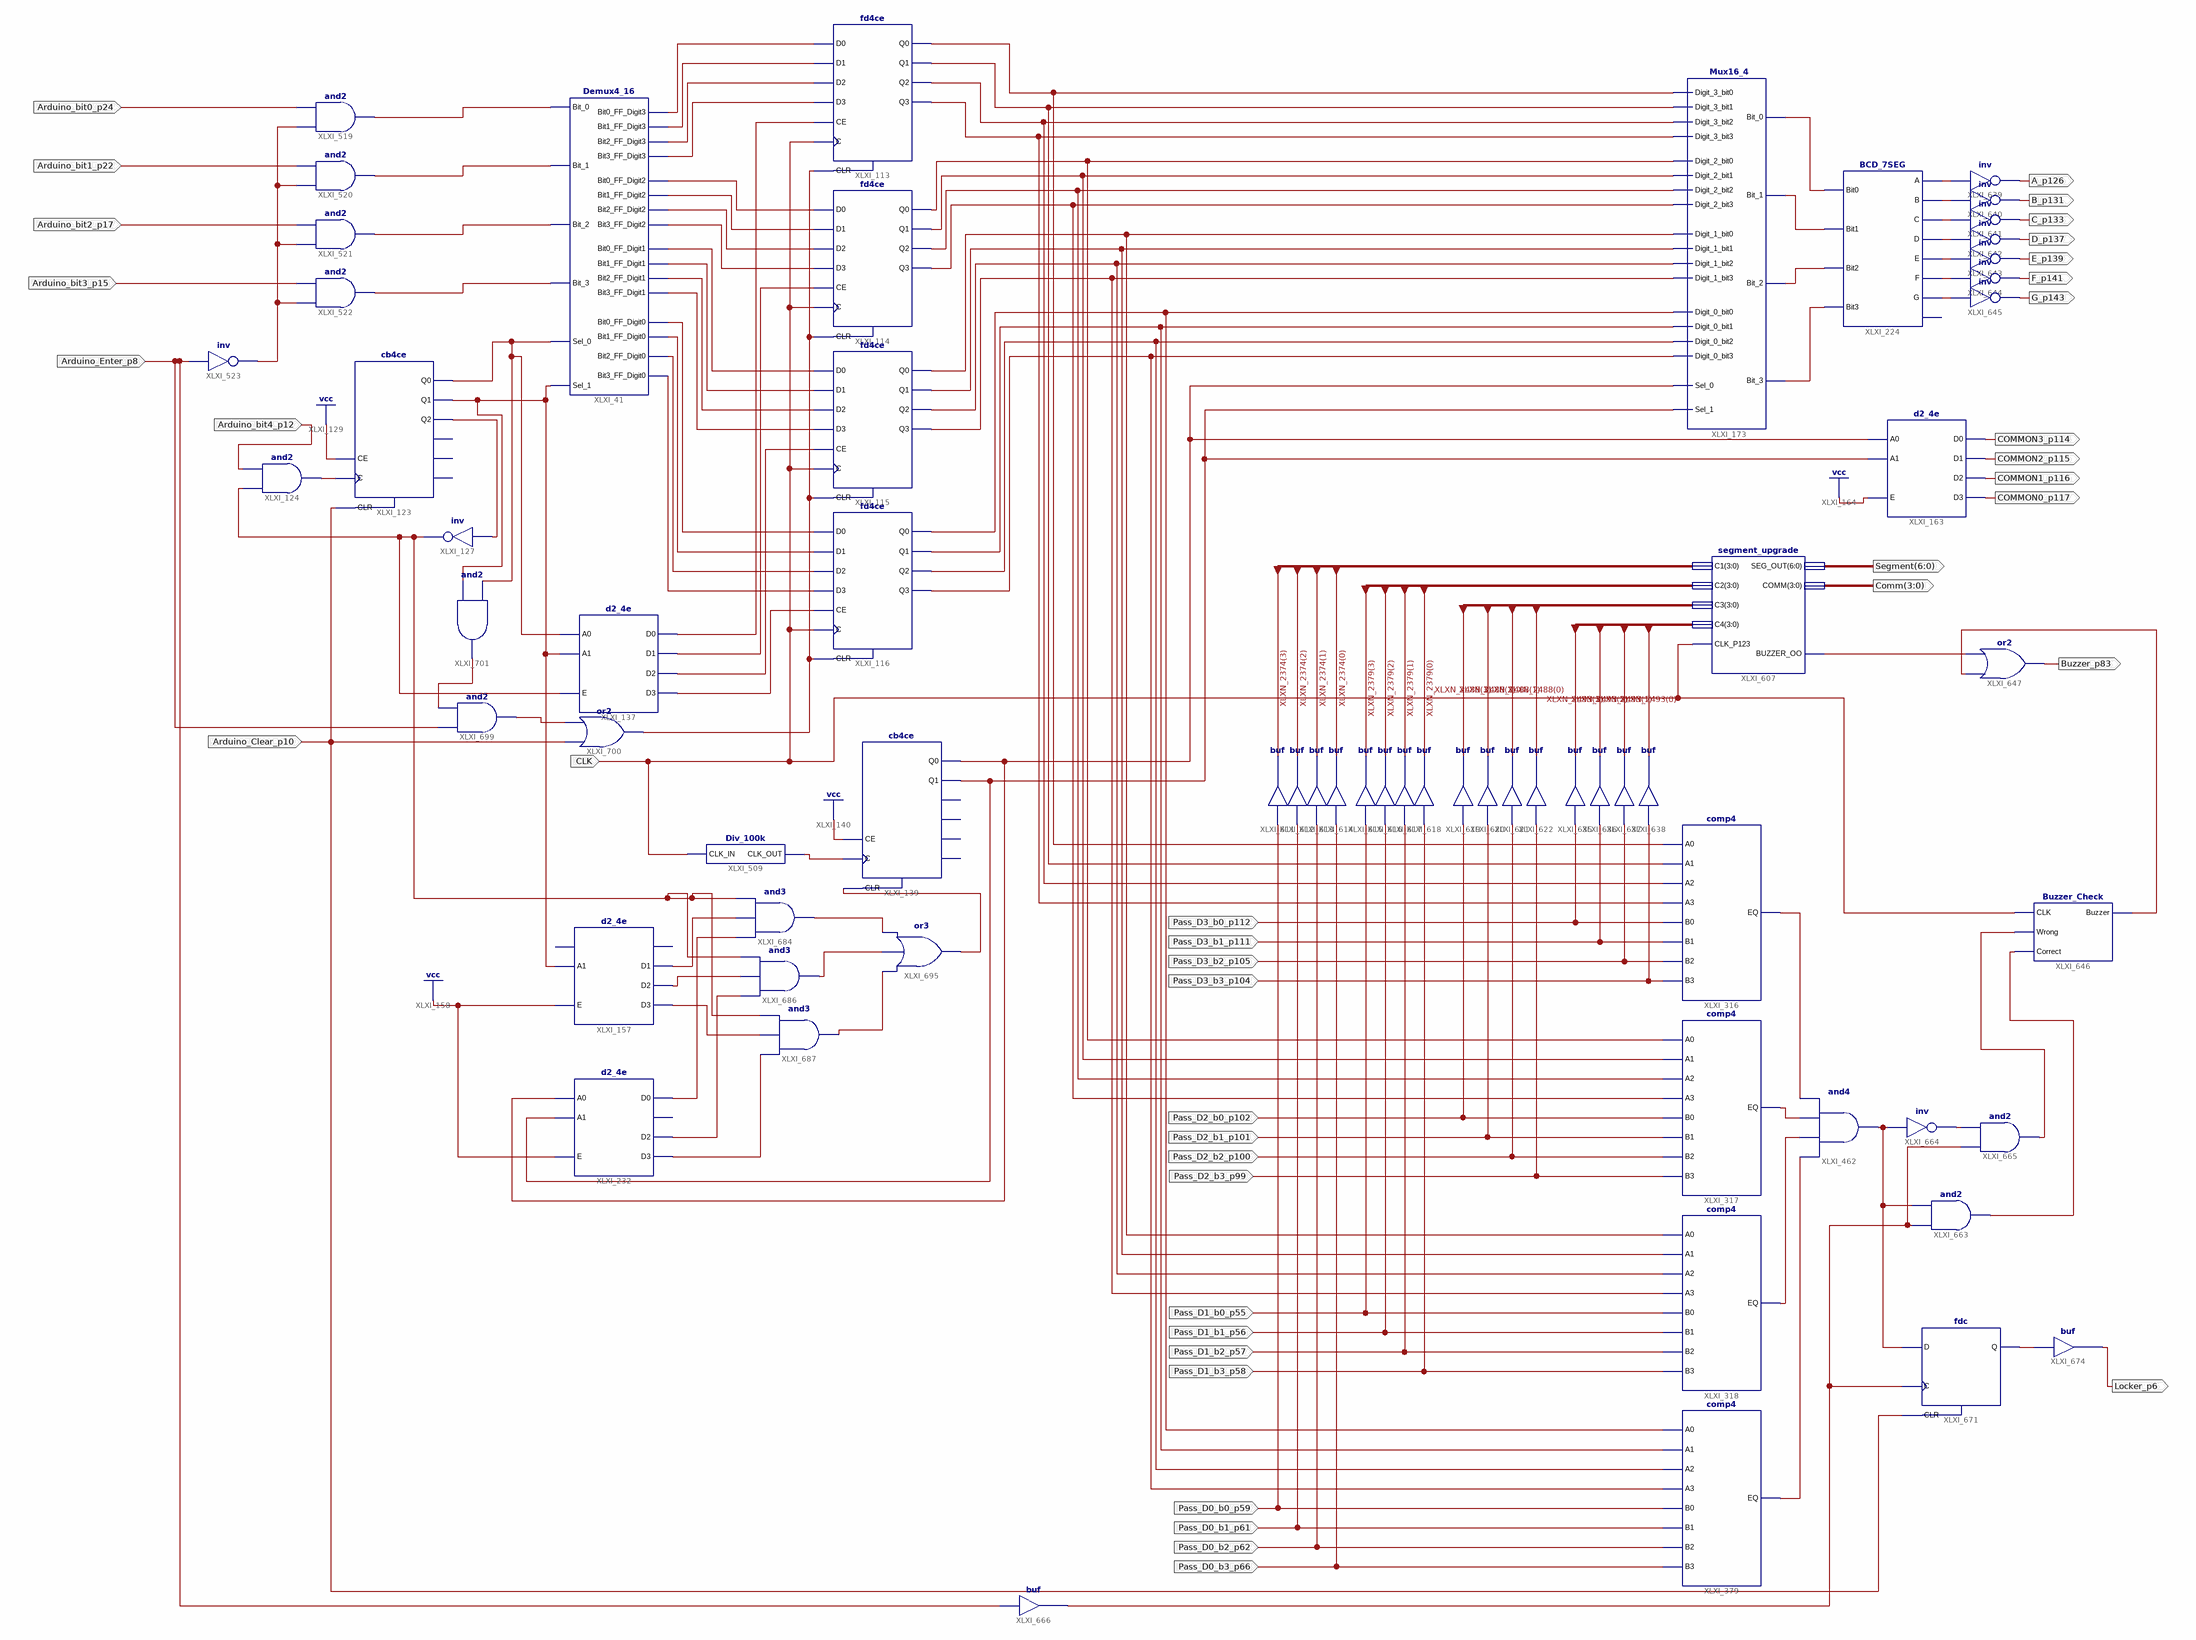
[diagram p0: schematic sheet 1]
// Xilinx ISE schematic Digital_Locker.sch (spartan6) as structural Verilog: 65 symbols, 39 ports
module Digital_Locker (
  input  Arduino_Clear_p10,
  input  Arduino_bit4_p12,
  input  Pass_D1_b0_p55,
  input  Pass_D1_b1_p56,
  input  Pass_D1_b2_p57,
  input  Pass_D1_b3_p58,
  input  Arduino_bit0_p24,
  input  Arduino_bit1_p22,
  input  Arduino_bit2_p17,
  input  Arduino_bit3_p15,
  input  Arduino_Enter_p8,
  input  Pass_D3_b0_p112,
  input  Pass_D3_b1_p111,
  input  Pass_D3_b2_p105,
  input  Pass_D3_b3_p104,
  input  Pass_D0_b0_p59,
  input  Pass_D0_b1_p61,
  input  Pass_D0_b2_p62,
  input  Pass_D2_b0_p102,
  input  Pass_D2_b1_p101,
  input  Pass_D2_b2_p100,
  input  Pass_D2_b3_p99,
  input  CLK,
  input  Pass_D0_b3_p66,
  output [6:0] Segment,
  output [3:0] Comm,
  output A_p126,
  output B_p131,
  output C_p133,
  output D_p137,
  output E_p139,
  output F_p141,
  output G_p143,
  output Buzzer_p83,
  output COMMON0_p117,
  output COMMON1_p116,
  output COMMON2_p115,
  output COMMON3_p114,
  output Locker_p6
);

  wire XLXN_517, XLXN_528, XLXN_545, XLXN_546, XLXN_547, XLXN_548, XLXN_549, XLXN_550, XLXN_551, XLXN_552,
       XLXN_553, XLXN_554, XLXN_555, XLXN_556, XLXN_557, XLXN_558, XLXN_559, XLXN_560, XLXN_587, XLXN_588,
       XLXN_589, XLXN_590, XLXN_758, XLXN_822, XLXN_823, XLXN_824, XLXN_825, XLXN_1236, XLXN_1237, XLXN_1238,
       XLXN_1239, XLXN_1240, XLXN_1241, XLXN_1242, XLXN_1243, XLXN_1244, XLXN_1245, XLXN_1246, XLXN_1247,
       XLXN_1250, XLXN_1251, XLXN_1252, XLXN_1556, XLXN_1557, XLXN_1558, XLXN_1559, XLXN_1913, XLXN_1953,
       XLXN_1954, XLXN_1955, XLXN_1956, XLXN_1961, XLXN_2069, XLXN_2506, XLXN_2507, XLXN_2508, XLXN_2509,
       XLXN_2510, XLXN_2511, XLXN_2512, XLXN_2553, XLXN_2556, XLXN_2636, XLXN_2644, XLXN_2655, XLXN_2659,
       XLXN_2666, XLXN_2738, XLXN_2861, XLXN_2866, XLXN_2867, XLXN_2868, XLXN_2875, XLXN_2885, XLXN_2886,
       XLXN_2891, XLXN_2892, XLXN_2893, XLXN_2931, XLXN_2942, XLXN_2944, XLXN_2949, XLXN_2956, XLXN_2963,
       XLXN_2964;
  wire [3:0] XLXN_2374, XLXN_2379, XLXN_2488, XLXN_2493;

  and XLXI_124 (XLXN_528, XLXN_2931, Arduino_bit4_p12);
  Mux16_4 XLXI_173 (
    .Bit_1(XLXN_823), .Digit_2_bit3(XLXN_1240), .Digit_3_bit0(XLXN_1239), .Digit_3_bit1(XLXN_1238),
    .Digit_3_bit2(XLXN_1237), .Digit_3_bit3(XLXN_1236), .Digit_2_bit0(XLXN_1243), .Digit_2_bit1(XLXN_1242),
    .Digit_2_bit2(XLXN_1241), .Digit_1_bit0(XLXN_1247), .Digit_1_bit3(XLXN_1244), .Digit_1_bit1(XLXN_1246),
    .Digit_1_bit2(XLXN_1245), .Digit_0_bit0(XLXN_1252), .Digit_0_bit1(XLXN_1251), .Digit_0_bit2(XLXN_1250),
    .Digit_0_bit3(XLXN_758), .Sel_1(XLXN_2069), .Sel_0(XLXN_2666), .Bit_0(XLXN_822), .Bit_3(XLXN_825),
    .Bit_2(XLXN_824));
  d2_4e XLXI_232 (
    .A0(XLXN_2666), .A1(XLXN_2069), .E(1'b1), .D0(XLXN_2868), .D2(XLXN_2886), .D3(XLXN_2892));  // open: D1
  d2_4e XLXI_157 (.A1(XLXN_2963), .E(1'b1), .D1(XLXN_2867), .D2(XLXN_2875), .D3(XLXN_2891));  // open: A0, D0
  fd4ce XLXI_114 (
    .C(CLK), .CE(XLXN_589), .CLR(XLXN_2949), .D0(XLXN_549), .D1(XLXN_550), .D2(XLXN_551), .D3(XLXN_552),
    .Q0(XLXN_1243), .Q1(XLXN_1242), .Q2(XLXN_1241), .Q3(XLXN_1240));
  not XLXI_127 (XLXN_2931, XLXN_517);
  d2_4e XLXI_137 (
    .A0(XLXN_2964), .A1(XLXN_2963), .E(XLXN_2931), .D0(XLXN_590), .D1(XLXN_589), .D2(XLXN_588), .D3(XLXN_587));
  cb4ce XLXI_123 (
    .C(XLXN_528), .CE(1'b1), .CLR(Arduino_Clear_p10), .Q0(XLXN_2964), .Q1(XLXN_2963), .Q2(XLXN_517));  // open: CEO, Q3, TC
  fd4ce XLXI_116 (
    .C(CLK), .CE(XLXN_587), .CLR(XLXN_2949), .D0(XLXN_557), .D1(XLXN_558), .D2(XLXN_559), .D3(XLXN_560),
    .Q0(XLXN_1252), .Q1(XLXN_1251), .Q2(XLXN_1250), .Q3(XLXN_758));
  fd4ce XLXI_115 (
    .C(CLK), .CE(XLXN_588), .CLR(XLXN_2949), .D0(XLXN_553), .D1(XLXN_554), .D2(XLXN_555), .D3(XLXN_556),
    .Q0(XLXN_1247), .Q1(XLXN_1246), .Q2(XLXN_1245), .Q3(XLXN_1244));
  fd4ce XLXI_113 (
    .C(CLK), .CE(XLXN_590), .CLR(XLXN_2949), .D0(XLXN_545), .D1(XLXN_546), .D2(XLXN_547), .D3(XLXN_548),
    .Q0(XLXN_1239), .Q1(XLXN_1238), .Q2(XLXN_1237), .Q3(XLXN_1236));
  Demux4_16 XLXI_41 (
    .Bit_0(XLXN_1953), .Bit_1(XLXN_1954), .Bit_2(XLXN_1955), .Bit_3(XLXN_1956), .Sel_0(XLXN_2964),
    .Bit0_FF_Digit3(XLXN_545), .Bit1_FF_Digit3(XLXN_546), .Bit2_FF_Digit3(XLXN_547),
    .Bit3_FF_Digit3(XLXN_548), .Bit0_FF_Digit2(XLXN_549), .Bit1_FF_Digit2(XLXN_550),
    .Bit2_FF_Digit2(XLXN_551), .Bit3_FF_Digit2(XLXN_552), .Bit0_FF_Digit1(XLXN_553),
    .Bit1_FF_Digit1(XLXN_554), .Sel_1(XLXN_2963), .Bit2_FF_Digit1(XLXN_555), .Bit3_FF_Digit1(XLXN_556),
    .Bit1_FF_Digit0(XLXN_558), .Bit0_FF_Digit0(XLXN_557), .Bit3_FF_Digit0(XLXN_560), .Bit2_FF_Digit0(XLXN_559));
  Div_100k XLXI_509 (.CLK_IN(CLK), .CLK_OUT(XLXN_1913));
  and XLXI_519 (XLXN_1953, XLXN_1961, Arduino_bit0_p24);
  and XLXI_520 (XLXN_1954, XLXN_1961, Arduino_bit1_p22);
  and XLXI_521 (XLXN_1955, XLXN_1961, Arduino_bit2_p17);
  and XLXI_522 (XLXN_1956, XLXN_1961, Arduino_bit3_p15);
  not XLXI_523 (XLXN_1961, Arduino_Enter_p8);
  cb4ce XLXI_139 (.C(XLXN_1913), .CE(1'b1), .CLR(XLXN_2861), .Q0(XLXN_2666), .Q1(XLXN_2069));  // open: CEO, Q2, Q3, TC
  buf XLXI_619 (XLXN_2488[3], Pass_D2_b0_p102);
  buf XLXI_620 (XLXN_2488[2], Pass_D2_b1_p101);
  buf XLXI_621 (XLXN_2488[1], Pass_D2_b2_p100);
  buf XLXI_622 (XLXN_2488[0], Pass_D2_b3_p99);
  and XLXI_462 (XLXN_2636, XLXN_1559, XLXN_1558, XLXN_1557, XLXN_1556);
  comp4 XLXI_316 (
    .A0(XLXN_1239), .A1(XLXN_1238), .A2(XLXN_1237), .A3(XLXN_1236), .B0(Pass_D3_b0_p112),
    .B1(Pass_D3_b1_p111), .B2(Pass_D3_b2_p105), .B3(Pass_D3_b3_p104), .EQ(XLXN_1556));
  comp4 XLXI_317 (
    .A0(XLXN_1243), .A1(XLXN_1242), .A2(XLXN_1241), .A3(XLXN_1240), .B0(Pass_D2_b0_p102),
    .B1(Pass_D2_b1_p101), .B2(Pass_D2_b2_p100), .B3(Pass_D2_b3_p99), .EQ(XLXN_1557));
  comp4 XLXI_318 (
    .A0(XLXN_1247), .A1(XLXN_1246), .A2(XLXN_1245), .A3(XLXN_1244), .B0(Pass_D1_b0_p55), .B1(Pass_D1_b1_p56),
    .B2(Pass_D1_b2_p57), .B3(Pass_D1_b3_p58), .EQ(XLXN_1558));
  comp4 XLXI_379 (
    .A0(XLXN_1252), .A1(XLXN_1251), .A2(XLXN_1250), .A3(XLXN_758), .B0(Pass_D0_b0_p59), .B1(Pass_D0_b1_p61),
    .B2(Pass_D0_b2_p62), .B3(Pass_D0_b3_p66), .EQ(XLXN_1559));
  BCD_7SEG XLXI_224 (
    .F(XLXN_2511), .A(XLXN_2506), .B(XLXN_2507), .C(XLXN_2508), .D(XLXN_2509), .E(XLXN_2510), .G(XLXN_2512),
    .Bit0(XLXN_822), .Bit1(XLXN_823), .Bit2(XLXN_824), .Bit3(XLXN_825));  // open: Buzzer
  segment_upgrade XLXI_607 (
    .CLK_P123(CLK), .C4(XLXN_2493), .C3(XLXN_2488), .C2(XLXN_2379), .C1(XLXN_2374), .COMM(Comm),
    .SEG_OUT(Segment), .BUZZER_OO(XLXN_2553));
  buf XLXI_635 (XLXN_2493[3], Pass_D3_b0_p112);
  buf XLXI_636 (XLXN_2493[2], Pass_D3_b1_p111);
  buf XLXI_637 (XLXN_2493[1], Pass_D3_b2_p105);
  buf XLXI_638 (XLXN_2493[0], Pass_D3_b3_p104);
  not XLXI_639 (A_p126, XLXN_2506);
  not XLXI_640 (B_p131, XLXN_2507);
  not XLXI_641 (C_p133, XLXN_2508);
  not XLXI_642 (D_p137, XLXN_2509);
  not XLXI_643 (E_p139, XLXN_2510);
  not XLXI_644 (F_p141, XLXN_2511);
  not XLXI_645 (G_p143, XLXN_2512);
  buf XLXI_612 (XLXN_2374[2], Pass_D0_b1_p61);
  buf XLXI_613 (XLXN_2374[1], Pass_D0_b2_p62);
  buf XLXI_614 (XLXN_2374[0], Pass_D0_b3_p66);
  buf XLXI_615 (XLXN_2379[3], Pass_D1_b0_p55);
  buf XLXI_616 (XLXN_2379[2], Pass_D1_b1_p56);
  buf XLXI_617 (XLXN_2379[1], Pass_D1_b2_p57);
  buf XLXI_618 (XLXN_2379[0], Pass_D1_b3_p58);
  buf XLXI_611 (XLXN_2374[3], Pass_D0_b0_p59);
  Buzzer_Check XLXI_646 (.CLK(CLK), .Wrong(XLXN_2655), .Correct(XLXN_2738), .Buzzer(XLXN_2556));
  or XLXI_647 (Buzzer_p83, XLXN_2556, XLXN_2553);
  and XLXI_663 (XLXN_2738, XLXN_2659, XLXN_2636);
  not XLXI_664 (XLXN_2644, XLXN_2636);
  and XLXI_665 (XLXN_2655, XLXN_2659, XLXN_2644);
  buf XLXI_666 (XLXN_2659, Arduino_Enter_p8);
  d2_4e XLXI_163 (
    .A0(XLXN_2666), .A1(XLXN_2069), .E(1'b1), .D0(COMMON3_p114), .D1(COMMON2_p115), .D2(COMMON1_p116),
    .D3(COMMON0_p117));
  fdc XLXI_671 (.C(XLXN_2659), .CLR(Arduino_Clear_p10), .D(XLXN_2636), .Q(XLXN_2942));
  buf XLXI_674 (Locker_p6, XLXN_2942);
  and XLXI_684 (XLXN_2866, XLXN_2868, XLXN_2867, XLXN_2931);
  and XLXI_686 (XLXN_2885, XLXN_2886, XLXN_2875, XLXN_2931);
  and XLXI_687 (XLXN_2893, XLXN_2892, XLXN_2891, XLXN_2931);
  or XLXI_695 (XLXN_2861, XLXN_2893, XLXN_2885, XLXN_2866);
  and XLXI_699 (XLXN_2944, Arduino_Enter_p8, XLXN_2956);
  or XLXI_700 (XLXN_2949, Arduino_Clear_p10, XLXN_2944);
  and XLXI_701 (XLXN_2956, XLXN_2963, XLXN_2964);

  // Notes on the sheet:
  //   CLOCK_DEDICATED_ROUTE on signal Arduino_bit4_p12 = TRUE
  //   CLOCK_DEDICATED_ROUTE on signal Arduino_Enter_p8 = TRUE
endmodule
